# Altium schematic sheet RFID-Reader.SchDoc (part 1 of 3)
size A; SheetNumber: 4; SheetTotal: 5
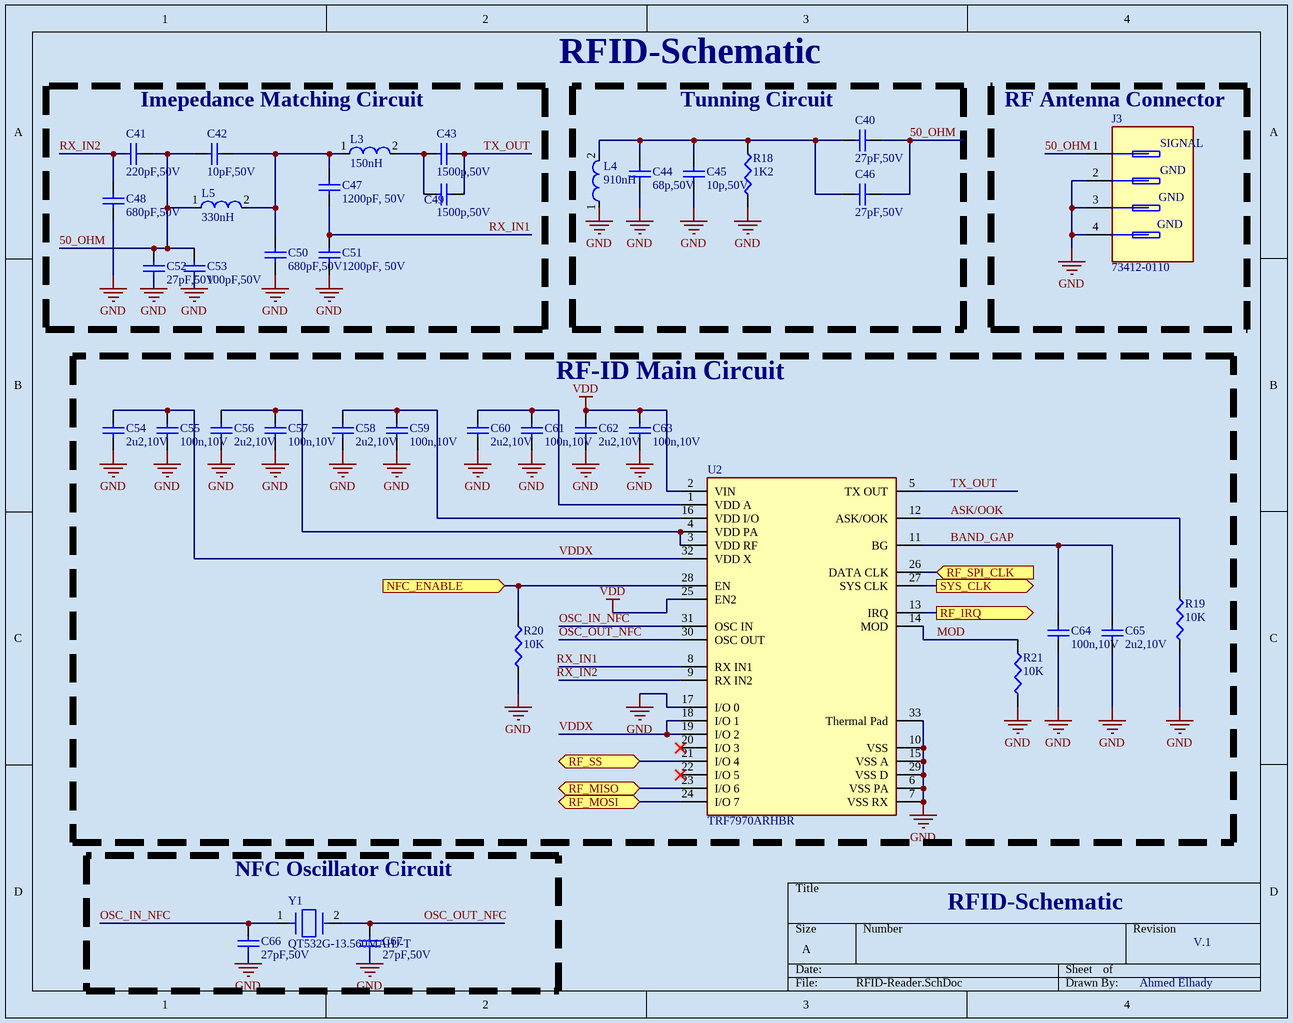
[diagram p0: RFID-Reader.SchDoc]

## Parts
C40  27pF,50V  [C0402-27pf-50V]
C41  220pF,50V  [220pf-50v-0402-yageo-CAPC1005X55N]
C42  10pF,50V  [YAGEO_10pf-50v-CC0402JRNPO9BN100_0]
C43  1500p,50V  [C0402-1500pF-Murata_GRM15_MFG]
C44  68p,50V  [TDK_C1005-68pf-50v]
C45  10p,50V  [YAGEO_10pf-50v-CC0402JRNPO9BN100_0]
C46  27pF,50V  [C0402-27pf-50V]
C47  1200pF, 50V  [1200F-50V-0402-Murata_GRM15_MFG]
C48  680pF,50V  [Kemet_C0402-680PF-50]
C49  1500p,50V  [C0402-1500pF-Murata_GRM15_MFG]
C50  680pF,50V  [Kemet_C0402-680PF-50]
C51  1200pF, 50V  [1200F-50V-0402-Murata_GRM15_MFG]
C52  27pF,50V  [C0402-27pf-50V]
C53  100pF,50V  [100pf-50v-0402-Murata_GRM15_MFG]
C54  2u2,10V  [C0402-2.2u-10V-Murata_GRM155-0_2_MFG]
C55  100n,10V  [C0402-100nF-10V]
C56  2u2,10V  [C0402-2.2u-10V-Murata_GRM155-0_2_MFG]
C57  100n,10V  [C0402-100nF-10V]
C58  2u2,10V  [C0402-2.2u-10V-Murata_GRM155-0_2_MFG]
C59  100n,10V  [C0402-100nF-10V]
C60  2u2,10V  [C0402-2.2u-10V-Murata_GRM155-0_2_MFG]
C61  100n,10V  [C0402-100nF-10V]
C62  2u2,10V  [C0402-2.2u-10V-Murata_GRM155-0_2_MFG]
C63  100n,10V  [C0402-100nF-10V]
C64  100n,10V  [C0402-100nF-10V]
C65  2u2,10V  [C0402-2.2u-10V-Murata_GRM155-0_2_MFG]
C66  27pF,50V  [C0402-27pf-50V]
C67  27pF,50V  [C0402-27pf-50V]
J3  73412-0110  [ANT_CONN_Molex_734-12-0110_0]
L3  150nH  [150nH-SMD2]
L4  910nH  [COIL_910nH_SMD]
L5  330nH  [330nh-SMD2]
R18  1K2  [RESC1005X40N-1.2k]
R19  10K  [YAGEO-0603-10K-0.1W]
R20  10K  [YAGEO-0603-10K-0.1W]
R21  10K  [YAGEO-0603-10K-0.1W]
U2  TRF7970ARHBR  [NFC_FP_TRF7970ARHBR]
Y1  QT532G-13.560MAHJ-T  [Crystal-13.56 MHz]

## Blocks framed on the sheet
Imepedance Matching Circuit: C41-C43 C47-C53 L3 L5
Tunning Circuit: C40 C44-C46 L4 R18
RF Antenna Connector: J3
RF-ID Main Circuit: C54-C65 R19-R21 U2
NFC Oscillator Circuit: C66 C67 Y1

## Ports
NFC_ENABLE (in, see Main Block Diagram[3C], ESP32-Main[3A]), RF_IRQ (out, see Main Block Diagram[3C], ESP32-Main[3A]), RF_MISO (bidir, see Main Block Diagram[3C], ESP32-Main[3B]), RF_MOSI (bidir, see Main Block Diagram[3C], ESP32-Main[3B]), RF_SPI_CLK (in, see Main Block Diagram[3C], ESP32-Main[3B]), RF_SS (bidir, see Main Block Diagram[3C], ESP32-Main[3A]), SYS_CLK (out, see Main Block Diagram[3C], ESP32-Main[2B])

## Nets
GND: C44.1 C45.2 C48.1 C50.1 C51.1 C52.1 C53.1 C54.1 C55.1 C56.1 C57.1 C58.1 C59.1 C60.1 C61.1 C62.1 C63.1 C64.1 C65.1 C66.1 C67.1 J3.2(GROUND) J3.3(GROUND) J3.4(GROUND) L4.1 R18.1 R19.1 R20.1 R21.1 U2.6(VSS_PA) U2.7(VSS_RX) U2.10(VSS) U2.15(VSS_A) U2.17(I/O_0) U2.29(VSS_D) U2.33(Thermal_Pad)
VDD: C62.2 C63.2 U2.2(VIN) U2.25(EN2)
50_OHM: C40.2 C41.1 C42.1 C46.2 C52.2 C53.2 J3.1(SIGNAL) L5.1
ASK/OOK: R19.2 U2.12(ASK/OOK)
BAND_GAP: C64.2 C65.2 U2.11(BG)
MOD: R21.2 U2.14(MOD)
NFC_ENABLE: R20.2 U2.28(EN) ; port NFC_ENABLE
OSC_IN_NFC: C66.2 U2.31(OSC_IN) Y1.1
OSC_OUT_NFC: C67.2 U2.30(OSC_OUT) Y1.2
RF_IRQ: U2.13(IRQ) ; port RF_IRQ
RF_MISO: U2.23(I/O_6) ; port RF_MISO
RF_MOSI: U2.24(I/O_7) ; port RF_MOSI
RF_SPI_CLK: U2.26(DATA_CLK) ; port RF_SPI_CLK
RF_SS: U2.21(I/O_4) ; port RF_SS
RX_IN1: C47.1 C51.2 U2.8(RX_IN1)
RX_IN2: C41.2 C48.2 U2.9(RX_IN2)
SYS_CLK: U2.27(SYS_CLK) ; port SYS_CLK
TX_OUT: C43.2 C49.2 U2.5(TX_OUT)
VDDX: C54.2 C55.2 U2.18(I/O_1) U2.19(I/O_2) U2.32(VDD_X)
NetC40_1: C40.1 C44.2 C45.1 C46.1 L4.2 R18.2
NetC42_2: C42.2 C47.2 C50.2 L3.1 L5.2
NetC43_1: C43.1 C49.1 L3.2
NetC56_2: C56.2 C57.2 U2.3(VDD_RF) U2.4(VDD_PA)
NetC58_2: C58.2 C59.2 U2.16(VDD_I/O)
NetC60_2: C60.2 C61.2 U2.1(VDD_A)

Not connected (* = marked no-connect by the designer): U2 20(I/O_3)* 22(I/O_5)*

## Notes on the sheet
- RFID-Schematic
- V.1
- Ahmed Elhady
- (in symbol 73412-0110) GND